# Altium schematic sheet BMU_schematic.SchDoc
size A3
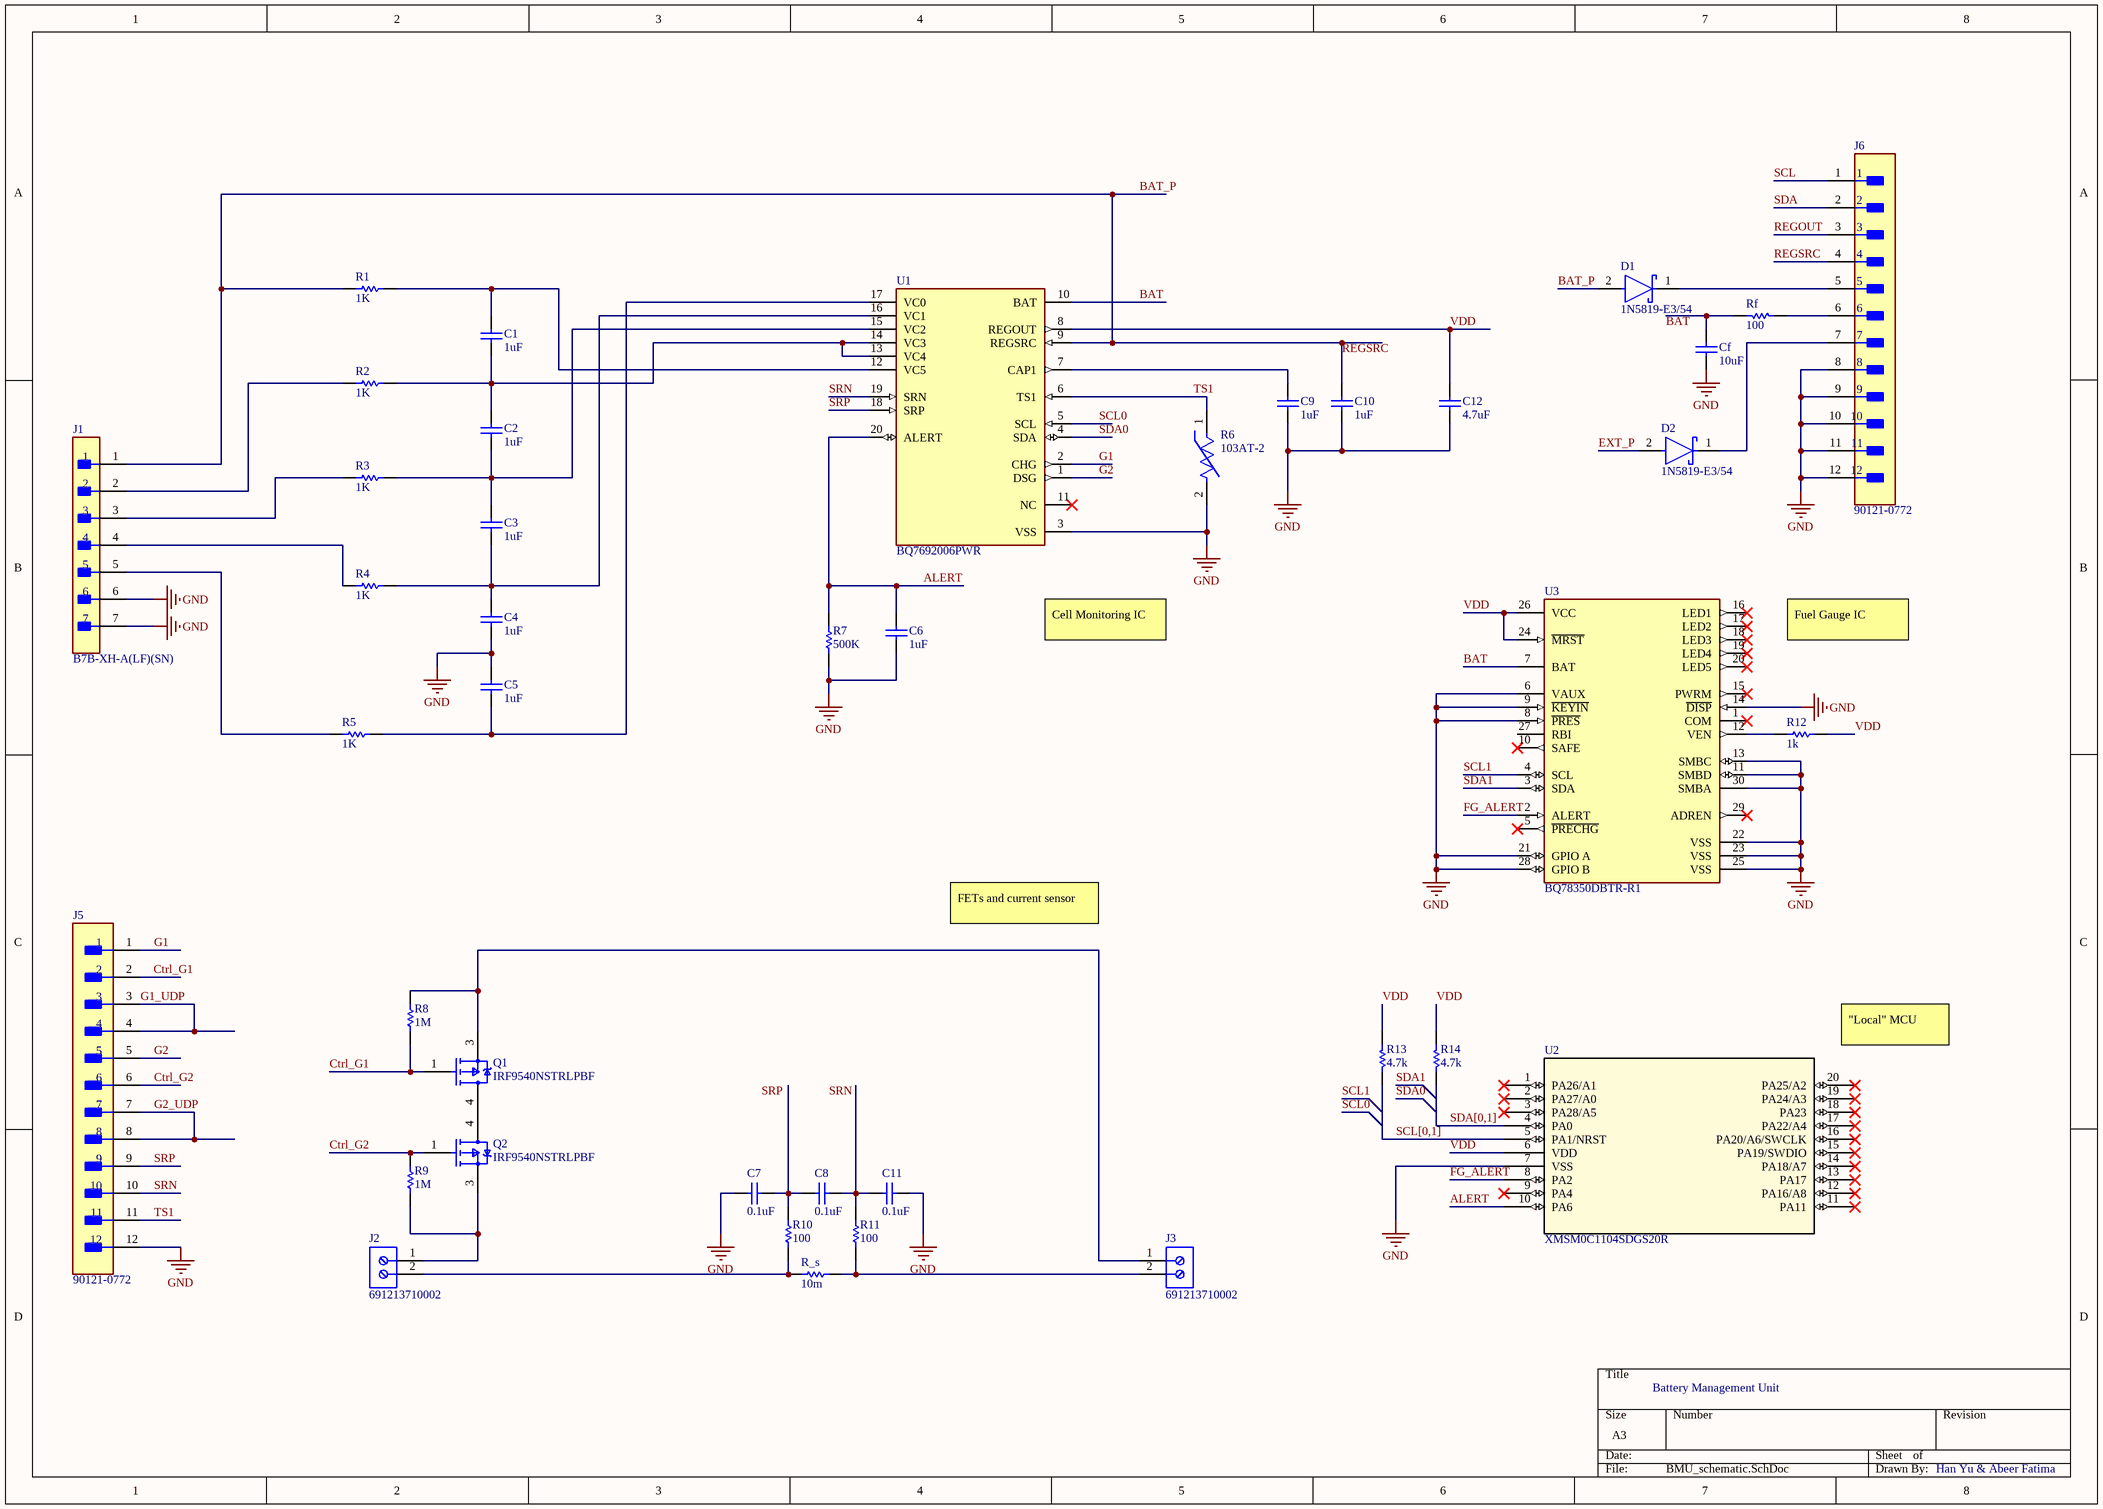
[diagram p0: BMU_schematic.SchDoc]

## Parts
C1  value 1uF  (hidden comment: Capacitor)
C2  value 1uF  (hidden comment: Capacitor)
C3  value 1uF  (hidden comment: Capacitor)
C4  value 1uF  (hidden comment: Capacitor)
C5  value 1uF  (hidden comment: Capacitor)
C6  value 1uF  (hidden comment: Capacitor)
C7  value 0.1uF  (hidden comment: Capacitor)
C8  value 0.1uF  (hidden comment: Capacitor)
C9  value 1uF  (hidden comment: Capacitor)
C10  value 1uF  (hidden comment: Capacitor)
C11  value 0.1uF  (hidden comment: Capacitor)
C12  value 4.7uF  (hidden comment: Capacitor)
Cf  value 10uF  (hidden comment: Capacitor)
D1  1N5819-E3/54  [FP-1N5819-E3-54-MFG]
D2  1N5819-E3/54  [FP-1N5819-E3-54-MFG]
J1  B7B-XH-A(LF)(SN)  [FP-B7B-XH-A_LF_SN-MFG]
J2  691213710002  [691213710002]
J3  691213710002  [691213710002]
J5  90121-0772  [FP-90121-0772-MFG]
J6  90121-0772  [FP-90121-0772-MFG]
Q1  IRF9540NSTRLPBF  [FP-PG-TO263-3-MFG]
Q2  IRF9540NSTRLPBF  [FP-PG-TO263-3-MFG]
R1  value 1K  (hidden comment: Resistor)
R2  value 1K  (hidden comment: Resistor)
R3  value 1K  (hidden comment: Resistor)
R4  value 1K  (hidden comment: Resistor)
R5  value 1K  (hidden comment: Resistor)
R6  103AT-2  [FP-103AT-2-MFG]
R7  value 500K  (hidden comment: Resistor)
R8  value 1M  (hidden comment: Resistor)
R9  value 1M  (hidden comment: Resistor)
R10  value 100  (hidden comment: Resistor)
R11  value 100  (hidden comment: Resistor)
R12  value 1k  (hidden comment: Resistor)
R13  value 4.7k  (hidden comment: Resistor)
R14  value 4.7k  (hidden comment: Resistor)
R_s  value 10m  (hidden comment: Resistor)
Rf  value 100  (hidden comment: Resistor)
U1  BQ7692006PWR  [FP-PW0020A-IPC_B]
U2  XMSM0C1104SDGS20R  [VSSOP20_DGS_TEX]
U3  BQ78350DBTR-R1  [FP-DBT0030A-MFG]

## Nets
GND: C4.1 C5.2 C6.1 C7.2 C9.1 C10.1 C11.1 C12.1 Cf.1 J1.6 J1.7 J5.12 J6.8 J6.9 J6.10 J6.11 J6.12 R6.2 R7.1 U1.3(VSS) U2.7(VSS) U3.6(VAUX) U3.8(~{PRES}) U3.9(~{KEYIN}) U3.11(SMBD) U3.13(SMBC) U3.14(~{DISP}) U3.21(GPIO_A) U3.22(VSS) U3.23(VSS) U3.25(VSS) U3.28(GPIO_B) U3.30(SMBA)
ALERT: C6.2 R7.2 U1.20(ALERT) U2.10(PA6)
BAT: U1.10(BAT) U3.7(BAT)
BAT_P: C10.2 D1.2(A) J1.1 J6.4 R1.1 U1.9(REGSRC)  [also labelled REGSRC]
Ctrl_G1: J5.2 Q1.1(GATE) R8.1
Ctrl_G2: J5.6 Q2.1(GATE) R9.2
EXT_P: D2.2(A)
FG_ALERT: U2.8(PA2) U3.2(ALERT)
G1: J5.1 U1.2(CHG)
G1_UDP: J5.3 J5.4
G2: J5.5 U1.1(DSG)
G2_UDP: J5.7 J5.8
REGOUT: J6.3
SCL: J6.1
SCL0: U1.5(SCL)
SCL1: U3.4(SCL)
SDA: J6.2
SDA0: U1.4(SDA)
SDA1: U3.3(SDA)
SRN: J5.10 U1.19(SRN)
SRP: J5.9 U1.18(SRP)
TS1: J5.11 R6.1 U1.6(TS1)
VDD: C12.2 R12.2 R13.2 R14.2 U1.8(REGOUT) U2.6(VDD) U3.24(~{MRST}) U3.26(VCC)
NetC1_1: C1.1 C2.2 R2.2 U1.13(VC4) U1.14(VC3)
NetC1_2: C1.2 R1.2 U1.12(VC5)
NetC2_1: C2.1 C3.2 R3.2 U1.15(VC2)
NetC3_1: C3.1 C4.2 R4.2 U1.16(VC1)
NetC5_1: C5.1 R5.2 U1.17(VC0)
NetC7_1: C7.1 C8.2 R10.2
NetC8_1: C8.1 C11.2 R11.2
NetC9_2: C9.2 U1.7(CAP1)
NetCf_2: Cf.2 Rf.2
NetD1_1: D1.1(C) J6.5
NetD2_1: D2.1(C) J6.7
NetJ1_2: J1.2 R2.1
NetJ1_3: J1.3 R3.1
NetJ1_4: J1.4 R4.1
NetJ1_5: J1.5 R5.1
NetJ2_1: J2.1 Q2.3(SOURCE) R9.1
NetJ2_2: J2.2 R10.1 R_s.1
NetJ3_1: J3.1 Q1.3(SOURCE) R8.2
NetJ3_2: J3.2 R11.1 R_s.2
NetJ6_6: J6.6 Rf.1
NetQ1_4: Q1.4(DRAIN) Q2.4(DRAIN)
NetR12_1: R12.1 U3.12(VEN)

Not connected (* = marked no-connect by the designer): R13 1; R14 1; U1 11(NC)*; U2 1(PA26/A1)* 2(PA27/A0)* 3(PA28/A5)* 4(PA0) 5(PA1/NRST) 9(PA4)* 11(PA11)* 12(PA16/A8)* 13(PA17)* 14(PA18/A7)* 15(PA19/SWDIO)* 16(PA20/A6/SWCLK)* 17(PA22/A4)* 18(PA23)* 19(PA24/A3)* 20(PA25/A2)*; U3 1(COM)* 5(~{PRECHG})* 10(SAFE)* 15(PWRM)* 16(LED1)* 17(LED2)* 18(LED3)* 19(LED4)* 20(LED5)* 27(RBI) 29(ADREN)*

## Buses and harness runs
bus SCL[0,1]
bus SDA[0,1]

## Notes on the sheet
- Cell Monitoring IC
- Fuel Gauge IC
- FETs and current sensor
- (near U2) "Local" MCU
- Battery Management Unit
- Han Yu & Abeer Fatima
- Labels drawn without touching a wire or pin: BAT, SRN, SRP

## Library data of the parts
C1-C12 Cf = Capacitor: SimulationGenericComponent: True
D1 D2 = CMP-02539-000037-2: DIODE SCHOTTKY 40V 1A DO204AL; Capacitance: 110pF; Element Configuration: Single; Peak Non-Repetitive Surge Current: 25A; Forward Voltage: 900mV; Polarity: Standard; Peak Reverse Current: 1mA; Max Operating Temperature: 125°C; Forward Current: 1A; Package Quantity: 1; Average Rectified Current: 1A; Voltage: 40V; Radiation Hardening: No; Current: 1A; Max Reverse Voltage (DC): 40V; Height: 2.7mm; Output Current: 1A; Lead Free: Lead Free; Diameter: 2.7mm; Min Operating Temperature: -65°C; Max Repetitive Reverse Voltage (Vrrm): 40V; Number of Pins: 2; Width: 2.7mm; Length: 5.2mm; Current Rating: 1A; Packaging: Tape and Reel; Mount: Through Hole; Max Forward Surge Current (Ifsm): 25A; Voltage Rating (DC): 40V
J1 = CMP-17439-000323-2: CONN HEADER VERT 7POS 2.5MM; Current Rating: 3A; Voltage Rating: 250V; Number of Contacts: 7; Mated Stacking Heights: 9.8mm; Insulation Resistance: 1GR; Contact Resistance: 20mR; Wire/Cable Gauge: 22AWG; Contact Finish - Mating: TIN; Orientation: Straight; REACH SVHC: No SVHC; Max Operating Temperature: 85°C; Housing Color: White; Pitch: 2.5mm; Mount: Through Hole; Packaging: Bulk; Depth: 5.75mm; Series: XH; Min Operating Temperature: -25°C; Length: 19.9mm; Connector Type: Header; Number of Positions: 7; Color: Natural; Max Current Rating: 3A; Lead Pitch: 2.5mm; Termination: Solder; Fastening Type: Detent; Flammability Rating: UL94 V-0; Voltage Rating (AC): 250V; Lead Free: Lead Free; Contact Material: Brass; Max Voltage Rating (AC): 250V; Contact Type: Male Pin; Housing Material: Polyamide; Insulation Color: Natural; Contact Shape: Square; Number of Rows: 1; Contact Plating: Tin; Insulation Material: Nylon
J2 J3 = CMP-1502-02526-2: NexarPartId: 8917718; Number of Contacts: 2; Current Rating: 10A; Stripping Length: -7mm; Wire Gauge (Max): 26AWG; Plating: Brass, Steel; Wire Gauge (Min): 16AWG; Voltage: 300V; Number of Levels: 1; Pitch: 5.0038mm; Color: Green; Number of Pins: 2; Housing Material: Nylon; Termination: Screw; Max Operating Temperature: 105°C; Min Operating Temperature: -40°C; Packaging: Box; Current: 10A; REACH SVHC: Unknown; Width: 10.6mm; RoHS: Compliant; Mount: Through Hole; Height: 10mm; Contact Material: Brass; Length: 8.3mm; Lead Pitch: 5mm; Wire/Cable Gauge: 26AWG; Voltage Rating: 300V; Number of Positions Per Level: 2; Contact Plating: Tin
J5 J6 = CMP-04776-000485-1: CONN HEADER R/A 12POS 2.54MM; Gender: Male; Number of Poles: 12; Insulation Resistance: 5GR; Voltage Rating: 350V; Current Rating: 3A; Connector Type: Male Pin; Glow Wire Compliant: Non-compliant; Contact Resistance: 20mR; Number of Circuits: 11; Housing Color: Black; Contact Mating Length: 0.266inch; Lead Free: Lead Free; Number of Rows: 1; Pitch: 2.54mm; Packaging: Bulk; Termination: Solder; Lead Pitch: 2.54mm; Number of Contacts: 12; Package Quantity: 1; RoHS Compliant: Yes; Min Operating Temperature: -55°C; Voltage Rating (AC): 350V; Number of Positions: 12; Contact Plating: Gold; Material: Glass; Series: C-Grid III; Max Operating Temperature: 125°C; Orientation: Right Angle; Mount: Through Hole; Housing Material: Polyester; Color: Black; Radiation Hardening: No; Working Voltage: 350V; Contact Material: Brass; Contact Type: Male Pin
Q1 Q2 = CMP-32901-000164-1: MOSFET P-CH 100V 23A D2PAK; Manufacturer: Infineon; Drain To Source Resistance: 117mΩ; Depletion Mode: False; Max Junction Temp: +150°C; Drain To Source Breakdown Voltage: -100V; Reverse Recovery Charge: 890nC; Pulse Drain Current: -92A; Standoff Height: 0mm; Power Dissipation: 110W; Max Forward Diode Voltage: -1.6V; Reverse Recovery Time: 140ns; Turn Off Delay Time: 40ns; Number Of Channels: 1; Continuous Drain Current: -23A; Rthja Max: 40°C/W; Gate Charge At Vgs: 73nC @ -10V; Turn On Delay Time: 13ns; Gate To Source Voltage: 20V; Input Capacitace At Vds: 1450pF @ -25V; Threshold Vgs Max: -4V; Threshold Vgs Min: -2V; Footprint Url: https://www.infineon.com/cms/en/product/packages/PG-TO263/PG-TO263-3-901/#!packing; Category: Trans; Device Class L2: Transistors; Digikey Description: MOSFET P-CH 100V 23A D2PAK; Package: PG-TO263-3; Drain To Source Voltage: -100V; ComponentLink2Description: Datasheet; Number Of P Channels: 1; RoHS: TRUE; Temperature: -55°C to +150°C; Temperature Range Low: -55°C; ComponentLink2URL: https://www.infineon.com/dgdl/irf9540nspbf.pdf?fileId=5546d462533600a401535611d92a1dca; Temperature Range High: +150°C; Manufacturer Part Number: IRF9540NSTRLPBF; Automotive: No; Device Class L1: Discrete Semiconductors; Octopart: https://octopart.com/irf9540nstrlpbf-infineon-65873776; Height: 5.084mm; Lead Free: Yes; Device Class L3: MOSFETs
R1-R5 R7-R14 R_s Rf = Resistor: TC1: 0; SimulationGenericComponent: True; TC2: 0
R6 = CMP-2000-05824-2: Thermistor NTC 10KOhm 1% 2-Pin; Resistance: 10kR; Lead Pitch: 2.54mm; Height: 2.4mm; Max Operating Temperature: 110°C; Width: 3.7mm; RoHS Compliant: Yes; Min Operating Temperature: -50°C; Termination: Radial; Packaging: Bulk; Number of Pins: 2; Series: AT; Tolerance: 1%; Length: 17mm
U1 = CMP-04911-000072-1: IC BATT MON MULTI 3-5C 20TSSOP; Output Voltage: 3.6V; Operating Supply Voltage: 25V; Interface: I2C; Fault Protection: Over Current; RoHS Compliant: Yes; Min Operating Temperature: -40°C; Weight: 0.002758oz; Mount: Surface Mount; Packaging: Tape and Reel; Package Quantity: 2000; Number of Pins: 20; Case/Package: TSSOP; Max Operating Temperature: 85°C; Contact Plating: Gold; Lead Free: Lead Free
U2 = XMSM0C1104SDGS20R: No Description Available; Mfr_Name: Texas Instruments; Type: Embedded; RefDes: RefDes
U3 = CMP-04911-000016-1: IC BATTERY MGMT CTRLR 30TSSOP; Manufacturer: Texas Instruments; Min Supply Voltage: 2.4V; Max Supply Voltage: 2.6V; Nominal Supply Current: 650uA; Standoff Height: 0.05mm; Digikey Description: IC BATTERY MGMT CTRLR 30TSSOP; Temperature Range Low: -40°C; Ipc Land Pattern Name: SOP50P640X120-30; Category: IC; ComponentLink2Description: Datasheet; Height: 1.2mm; Automotive: No; ComponentLink2URL: http://www.ti.com/lit/gpn/bq78350-r1; Device Class L3: Battery Management; Package: DBT0030A; Ambient Temperature Range Low: -40°C; Temperature: -40°C to +85°C; Mouser Description: Battery Management Companion CEDV Fuel Gauge batt contrl R 595-BQ78350DBTR-R1; Octopart: https://octopart.com/bq78350dbtr-r1-texas+instruments-65758954; Lead Free: Yes; RoHS: TRUE; Temperature Range High: +85°C; Manufacturer Part Number: BQ78350DBTR-R1; Device Class L1: Integrated Circuits (ICs); Ambient Temperature Range High: +85°C; Device Class L2: Power Management ICs